# Altium schematic sheet Sheet1.SchDoc
size A4
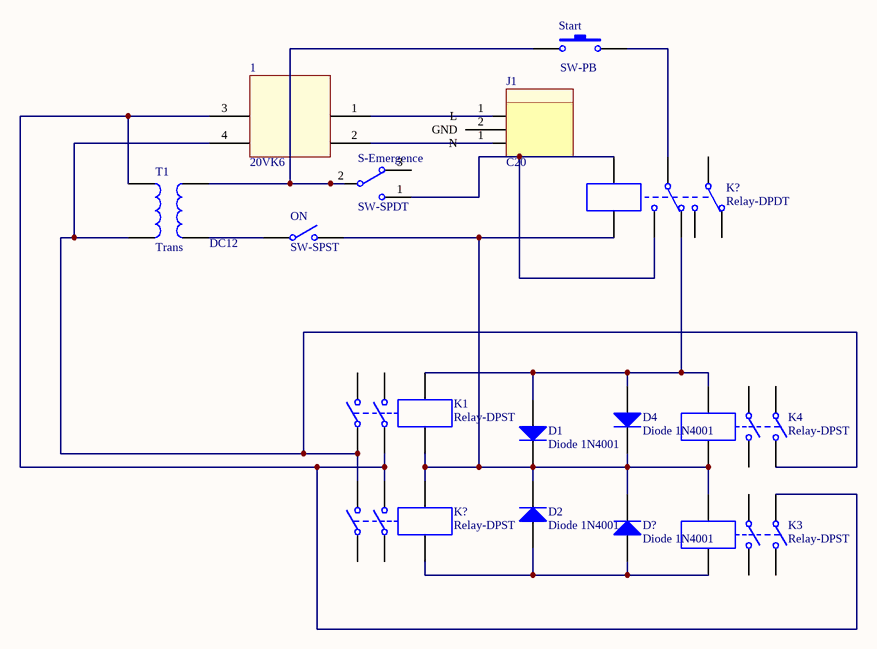
[diagram p0: Sheet1.SchDoc]

## Parts
(Parts that share a designator on the sheet are numbered #1, #2 ... from top to bottom, then left to right.)
1  20VK6
D1  Diode 1N4001  [DO-41]
D2  Diode 1N4001  [DO-41]
D4  Diode 1N4001  [DO-41]
D?  Diode 1N4001  [DO-41]
J1  C20
K1  Relay-DPST  [MODULE6]
K3  Relay-DPST  [MODULE6]
K4  Relay-DPST  [MODULE6]
K?#1  Relay-DPDT  [DIP-P8]
K?#2  Relay-DPST  [MODULE6]
ON  SW-SPST  [SPST-2]
S-Emergence  SW-SPDT  [TL36WW15050]
Start  SW-PB  [SPST-2]
T1  Trans  [TRANS]

## Nets
NetD1_1: D1.1(A) D4.1(A) K1.6 K4.5 K?#1.5
NetD1_2: D1.2(K) D2.2(K) D4.2(K) D?.2(K) K1.5 K3.5 K4.6 K?#1.8 K?#2.6 ON.2(NO)
NetD2_1: D2.1(A) D?.1(A) K3.6 K?#2.5
NetK1_1: K1.1 K4.2 K?#2.2 T1.2
NetK1_3: K1.3 K3.1 K?#2.4 T1.1
NetK?#1_4: K?#1.4 Start.2
NetK?#1_6: K?#1.6 K?#1.7 S-Emergence.1
NetON_1: ON.1(COMMON) T1.4
NetS-Emergence_2: S-Emergence.2 Start.1 T1.3

Not connected (* = marked no-connect by the designer): 1 1(5) 2(6) 3 4; J1 1(L) 2(GND); K1 2 4; K3 2 3 4; K4 1 3 4; K?#1 1 2 3; K?#2 1 3; S-Emergence 3

## Notes on the sheet
- (near T1) DC12

## Library data of the parts
D1 D2 D4 D? = Diode 1N4001: 1 Amp General Purpose Rectifier; Published: 8-Jun-2000; LatestRevisionDate: 17-Jul-2002; LatestRevisionNote: Re-released for DXP Platform.; DatasheetVersion: 1998; PackageVersion: Aug-1999; PackageReference: DO-41; Publisher: Altium Limited; PackageDescription: Diode, Axial; Body 5.2 x 2.7 mm (LxDia. max), Lead Dia. 0.86 mm (max); Code_JEDEC: DO-204-AL; ComponentLink1Description: Manufacturer Link; ComponentLink1URL: http://www.fairchildsemi.com/; ComponentLink2Description: Datasheet; ComponentLink2URL: http://www.fairchildsemi.com/ds/1N%2F1N4001.pdf
K1 K3 K4 K?#2 = Relay-DPST: Dual-Pole Single-Throw Relay; Published: 24-Mar-1999; LatestRevisionDate: 17-Jul-2002; LatestRevisionNote: Re-released for DXP Platform.; PackageReference: MODULE6; Publisher: Altium Limited
K?#1 = Relay-DPDT: Dual-Pole Dual-Throw Relay; Published: 24-Mar-1999; LatestRevisionDate: 17-Jul-2002; LatestRevisionNote: Re-released for DXP Platform.; PackageReference: DIP-P8; Publisher: Altium Limited; PackageDescription: Relay; 8 Leads
ON = SW-SPST: Single-Pole, Single-Throw Switch; Published: 24-Mar-1999; LatestRevisionDate: 17-Jul-2002; LatestRevisionNote: Re-released for DXP Platform.; PackageReference: SPST-2; Publisher: Altium Limited; PackageDescription: Switch; 2 Leads
S-Emergence = SW-SPDT: SPDT Subminiature Toggle Switch, Right Angle Mounting, Vertical Actuation; Published: 24-Mar-1999; LatestRevisionDate: 17-Dec-2003; LatestRevisionNote: Schematic revised, PCB Footprint replaced.; DatasheetVersion: 05-Dec-2000; PackageReference: TL36WW15050; Publisher: Altium Limited; PackageDescription: Switch; 4 Leads; ComponentLink1Description: Manufacturer Link; ComponentLink1URL: http://www.apem.com
Start = SW-PB: Switch; Published: 24-Mar-1999; LatestRevisionDate: 17-Jul-2002; LatestRevisionNote: Re-released for DXP Platform.; PackageReference: SPST-2; Publisher: Altium Limited; PackageDescription: Switch; 2 Leads
T1 = Trans: Transformer; Published: 24-Mar-1999; LatestRevisionDate: 08-Jul-2005; LatestRevisionNote: Mech Layer 1 removed.; PackageReference: TRANS; Publisher: Altium Limited; PackageDescription: Transformer; 4 Leads